# Altium schematic sheet Sheet2.SchDoc
size A; SheetNumber: 2; SheetTotal: 3
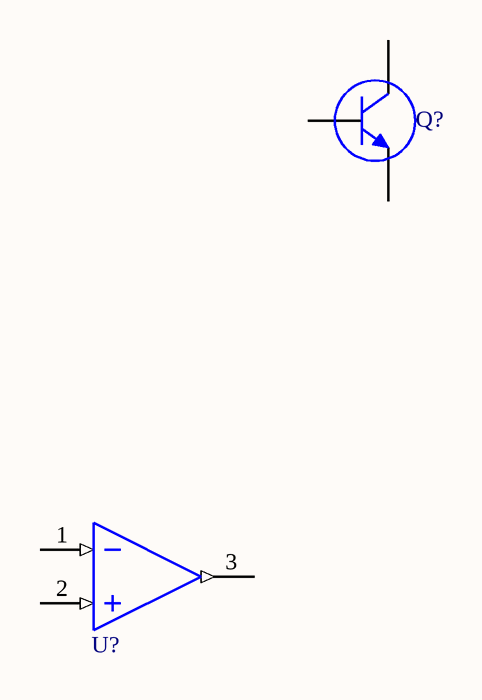
[diagram p0: Sheet2.SchDoc]

## Parts
Q?  Transistors  (value not drawn)
U?  Amplifiers  (value not drawn)

## Nets

Not connected (* = marked no-connect by the designer): Q? 1(E) 2(B) 3(C); U? 1(-IN) 2(+IN) 3(OUT)

## Library data of the parts
Q? = Transistors: NPN Transistor; Component Type: Transistors
U? = Amplifiers: Operational amplifier; Component Type: Amplifiers